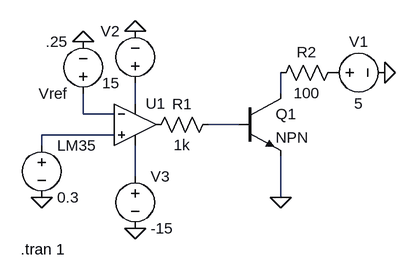
[diagram p0: schematic opampver.asc]
opampver.asc, the LTspice schematic file:
Version 4.1
SHEET 1 880 680
WIRE 304 -688 304 -720
WIRE 80 -672 80 -704
WIRE 0 -656 0 -688
WIRE 48 -656 0 -656
WIRE 240 -640 192 -640
WIRE 48 -624 -64 -624
WIRE -64 -608 -64 -624
WIRE 80 -560 80 -608
WIRE 304 -528 304 -592
FLAG -64 -528 0
FLAG 0 -768 0
FLAG 304 -528 0
FLAG 464 -720 0
FLAG 80 -784 0
FLAG 80 -480 0
SYMBOL OpAmps\\UniversalOpAmp2 80 -640 R0
SYMATTR InstName U1
SYMBOL voltage -64 -624 R0
WINDOW 123 0 0 Left 0
WINDOW 39 0 0 Left 0
SYMATTR InstName LM35
SYMATTR Value 0.3
SYMBOL voltage 0 -672 R180
WINDOW 123 0 0 Left 0
WINDOW 39 0 0 Left 0
SYMATTR InstName Vref
SYMATTR Value .25
SYMBOL npn 240 -688 R0
SYMATTR InstName Q1
SYMBOL res 208 -656 R90
WINDOW 0 0 56 VBottom 2
WINDOW 3 32 56 VTop 2
SYMATTR InstName R1
SYMATTR Value 1k
SYMBOL res 400 -736 R90
WINDOW 0 0 56 VBottom 2
WINDOW 3 32 56 VTop 2
SYMATTR InstName R2
SYMATTR Value 100
SYMBOL voltage 368 -720 R270
WINDOW 0 32 56 VTop 2
WINDOW 3 -32 56 VBottom 2
SYMATTR InstName V1
SYMATTR Value 5
SYMBOL voltage 80 -688 R180
WINDOW 0 24 96 Left 2
WINDOW 3 24 16 Left 2
SYMATTR InstName V2
SYMATTR Value 15
SYMBOL voltage 80 -576 R0
SYMATTR InstName V3
SYMATTR Value -15
TEXT -96 -448 Left 2 !.tran 1

The netlist it stands for:
* opampver.asc
X§U1 N005 N003 N002 N006 P001 level2 Avol=1Meg GBW=10Meg Slew=10Meg Ilimit=25m Rail=0 Vos=0 En=0 Enk=0 In=0 Ink=0 Rin=500Meg  ; pins In+ In- V+ V- OUT
V§LM35 N005 0 0.3
Vref N003 0 .25
Q1 N001 N004 0 0 NPN
R1 N004 P001 1k
R2 P002 N001 100
V1 P002 0 5
V2 N002 0 15
V3 N006 0 -15
.model NPN NPN
.model PNP PNP
.lib standard.bjt
.tran 1
.lib UniversalOpAmp2.lib
.backanno
.end